# Altium project Valve_Contoller.PrjPcb
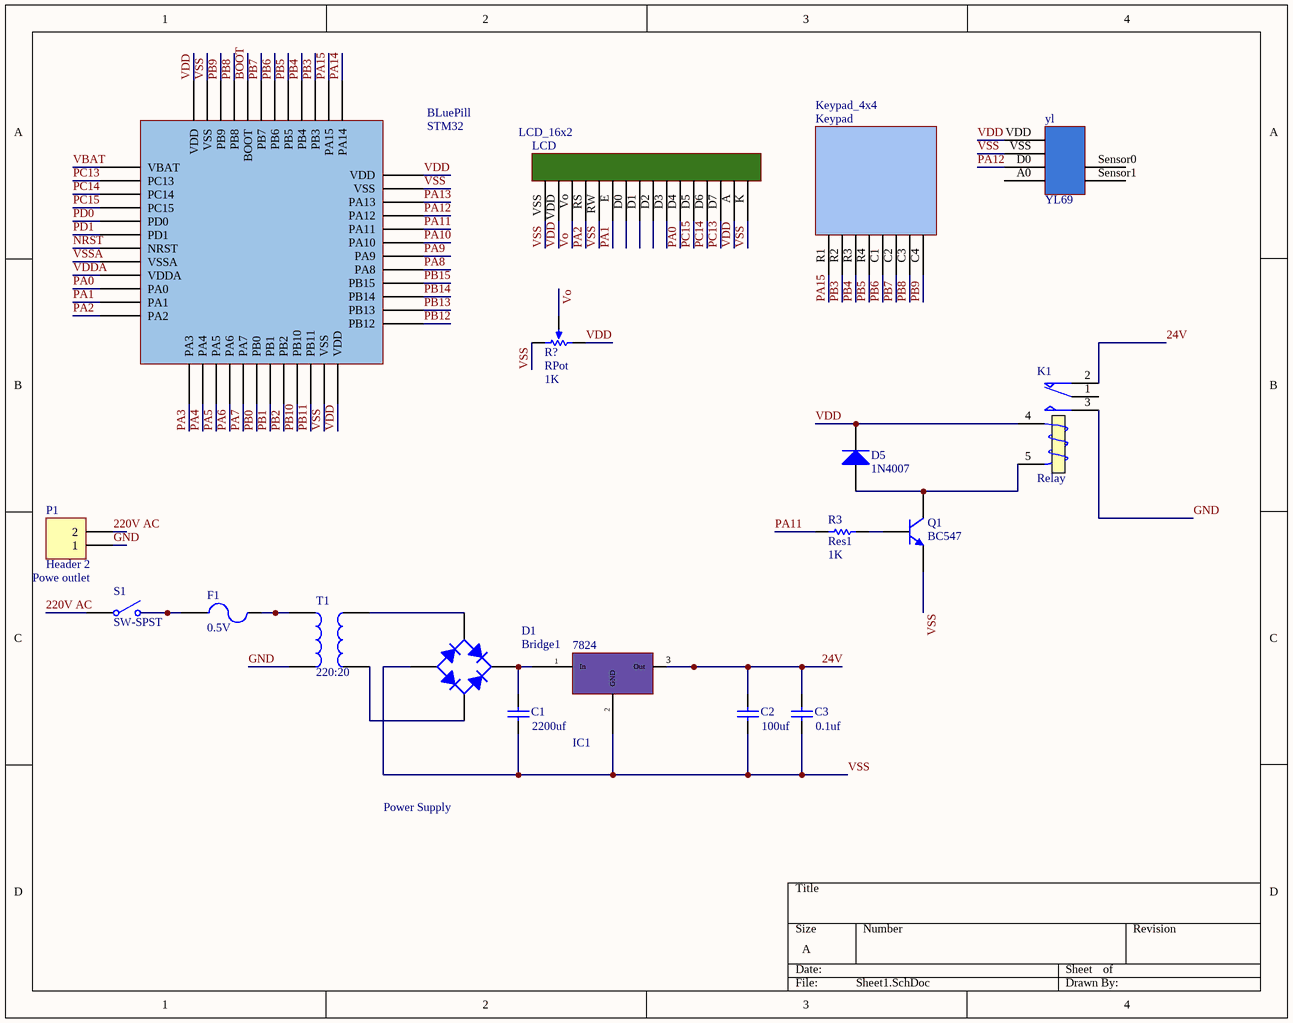
[diagram p0: Sheet1.SchDoc]
1 sheet, 18 parts. Net scope: global (net labels, ports and power ports of the same name join across sheets).

## Sheet Sheet1.SchDoc
size A

### Parts
7824  IC1
BLuePill  STM32
C1  value 2200uf  [RAD-0.3]  (hidden comment: Cap)
C2  value 100uf  [RAD-0.3]  (hidden comment: Cap)
C3  value 0.1uf  [RAD-0.3]  (hidden comment: Cap)
D1  Bridge1  [D-38]
D5  1N4007  [SOT-23_N]
F1  0.5V  [PIN-W2/E2.8]
K1  Relay  [MODULE5B]
Keypad  Keypad_4x4
LCD  LCD_16x2
P1  Header 2  [HDR1X2]
Q1  BC547  [SOT-23B_N]
R3  Res1  value 1K  [AXIAL-0.3]
R?  RPot  value 1K  [VR5]
S1  SW-SPST  [SPST-2]
T1  220:20  [TRANS]
yl  YL69

### Nets
24V: 7824.3(Out) C2.2 C3.2 K1.2(NC)
220V AC: P1.2 S1.1(COMMON)
BOOT: BLuePill.?44(BOOT)
GND: K1.3(NO) P1.1 T1.2
NRST: BLuePill.?7(NRST)
PA0: BLuePill.?10(PA0) LCD.D4
PA1: BLuePill.?11(PA1) LCD.E
PA2: BLuePill.?12(PA2) LCD.RS
PA3: BLuePill.?13(PA3)
PA4: BLuePill.?14(PA4)
PA5: BLuePill.?15(PA5)
PA6: BLuePill.?16(PA6)
PA7: BLuePill.?17(PA7)
PA8: BLuePill.?29(PA8)
PA9: BLuePill.?30(PA9)
PA10: BLuePill.?31(PA10)
PA11: BLuePill.?32(PA11) R3.1
PA12: BLuePill.?33(PA12) yl.D0
PA13: BLuePill.?34(PA13)
PA14: BLuePill.?37(PA14)
PA15: BLuePill.?38(PA15) Keypad.R1
PB0: BLuePill.?18(PB0)
PB1: BLuePill.?19(PB1)
PB2: BLuePill.?20(PB2)
PB3: BLuePill.?39(PB3) Keypad.R2
PB4: BLuePill.?40(PB4) Keypad.R3
PB5: BLuePill.?41(PB5) Keypad.R4
PB6: BLuePill.?42(PB6) Keypad.C1
PB7: BLuePill.?43(PB7) Keypad.C2
PB8: BLuePill.?45(PB8) Keypad.C3
PB9: BLuePill.?46(PB9) Keypad.C4
PB10: BLuePill.?21(PB10)
PB11: BLuePill.?22(PB11)
PB12: BLuePill.?25(PB12)
PB13: BLuePill.?26(PB13)
PB14: BLuePill.?27(PB14)
PB15: BLuePill.?28(PB15)
PC13: BLuePill.?2(PC13) LCD.D7
PC14: BLuePill.?3(PC14) LCD.D6
PC15: BLuePill.?4(PC15) LCD.D5
PD0: BLuePill.?5(PD0)
PD1: BLuePill.?6(PD1)
VBAT: BLuePill.?1(VBAT)
VDD: BLuePill.?24(VDD) BLuePill.?36(VDD) BLuePill.?48(VDD) D5.3(K) K1.4(T1) LCD.A LCD.VDD R?.1(TOP) yl.VDD
VDDA: BLuePill.?9(VDDA)
Vo: LCD.Vo R?.3(TAP)
VSS: 7824.2(GND) BLuePill.?23(VSS) BLuePill.?35(VSS) BLuePill.?47(VSS) C1.1 C2.1 C3.1 D1.3(A) LCD.K LCD.RW LCD.VSS Q1.3(E) R?.2(BOT) yl.VSS
VSSA: BLuePill.?8(VSSA)
Net7824_1: 7824.1(In) C1.2 D1.1(K)
NetD1_2: D1.2(C) T1.4
NetD1_4: D1.4(C) T1.3
NetD5_1: D5.1(A) K1.5(T2) Q1.1(C)
NetF1_1: F1.1 S1.2(NO)
NetF1_2: F1.2 T1.1
NetQ1_2: Q1.2(B) R3.2

Not connected (* = marked no-connect by the designer): K1 1(COM); LCD D0 D1 D2 D3; yl A0 Sensor0 Sensor1

### Notes on the sheet
- Powe outlet
- Power Supply

### Library data of the parts
C1-C3 = Cap: Capacitor; Published: 8-Jun-2000; LatestRevisionDate: 17-Jul-2002; LatestRevisionNote: Re-released for DXP Platform.; PackageReference: RAD-0.3; Publisher: Altium Limited; PackageDescription: Radial Cap, Thru-Hole; 2 Leads; 0.3 in Pin Spacing
D1 = Bridge1: Full Wave Diode Bridge; Published: 8-Jun-2000; LatestRevisionDate: 29-May-2009; LatestRevisionNote: Sch pins A & K swapped.; DatasheetVersion: E2732B; PackageReference: D-38; Publisher: Altium Limited; PackageDescription: Bridge Rectifier; 4 Terminals; Body 9.4 x 9.4 mm (typ); Pitch 5.08 mm
D5 = Diode BAT18: Low-Loss RF Switching Diode; Note: Pin 2 is not connected and not drawn.; Published: 21-Mar-2003; LatestRevisionDate: 29-May-2009; LatestRevisionNote: IPC-7351 Footprint Added.; DatasheetVersion: Oct-1999; PackageVersion: Sep-2001; PackageReference: SOT-23; Publisher: Altium Limited; PackageDescription: 3-Pin SOT-23 Package 0.95 mm Pitch, 2.5 mm Lead Span; ComponentLink1Description: Manufacturer Link; ComponentLink1URL: http://www.infineon.com/
F1 = Fuse 2: Fuse; Published: 8-Jun-2000; LatestRevisionDate: 17-Jul-2002; LatestRevisionNote: Re-released for DXP Platform.; PackageReference: PIN-W2/E2.8; Publisher: Altium Limited; PackageDescription: Thru-Hole; 2 Leads
K1 = Relay: SPDT Relay; Published: 8-Jun-2000; LatestRevisionDate: 17-Jul-2002; LatestRevisionNote: Re-released for DXP Platform.; PackageReference: MODULE5B; Publisher: Altium Limited
P1 = Header 2: Header, 2-Pin; LatestRevisionDate: 17-Jul-2002; LatestRevisionNote: Re-released for DXP Platform.; Publisher: Altium Limited
Q1 = QNPN: NPN Bipolar Transistor; Published: 8-Jun-2000; LatestRevisionDate: 29-May-2009; LatestRevisionNote: IPC-7351 Footprint Added.; PackageVersion: Aug-1999; PackageReference: SOT-23B; Publisher: Altium Limited; PackageDescription: 3-Pin SOT-23 Package 0.95 mm Pitch, 2.4 mm Lead Span
R3 = Res1: Resistor; Published: 8-Jun-2000; LatestRevisionDate: 17-Jul-2002; LatestRevisionNote: Re-released for DXP Platform.; PackageReference: AXIAL-0.3; Publisher: Altium Limited; PackageDescription: Axial Device, Thru-Hole; 2 Leads; 0.3 in Pin Spacing
R? = RPot: Potentiometer; Sim Note: Enter the Resistance value and the set point into parameter fields.; Set Position: 0.5; Published: 8-Jun-2000; LatestRevisionDate: 17-Jul-2002; LatestRevisionNote: Re-released for DXP Platform.; PackageReference: VR5; Publisher: Altium Limited; PackageDescription: Variable Resistor, Thru-Hole; 3 Leads
S1 = SW-SPST: Single-Pole, Single-Throw Switch; Published: 24-Mar-1999; LatestRevisionDate: 17-Jul-2002; LatestRevisionNote: Re-released for DXP Platform.; PackageReference: SPST-2; Publisher: Altium Limited; PackageDescription: Switch; 2 Leads
T1 = Trans: Transformer; Published: 24-Mar-1999; LatestRevisionDate: 08-Jul-2005; LatestRevisionNote: Mech Layer 1 removed.; PackageReference: TRANS; Publisher: Altium Limited; PackageDescription: Transformer; 4 Leads